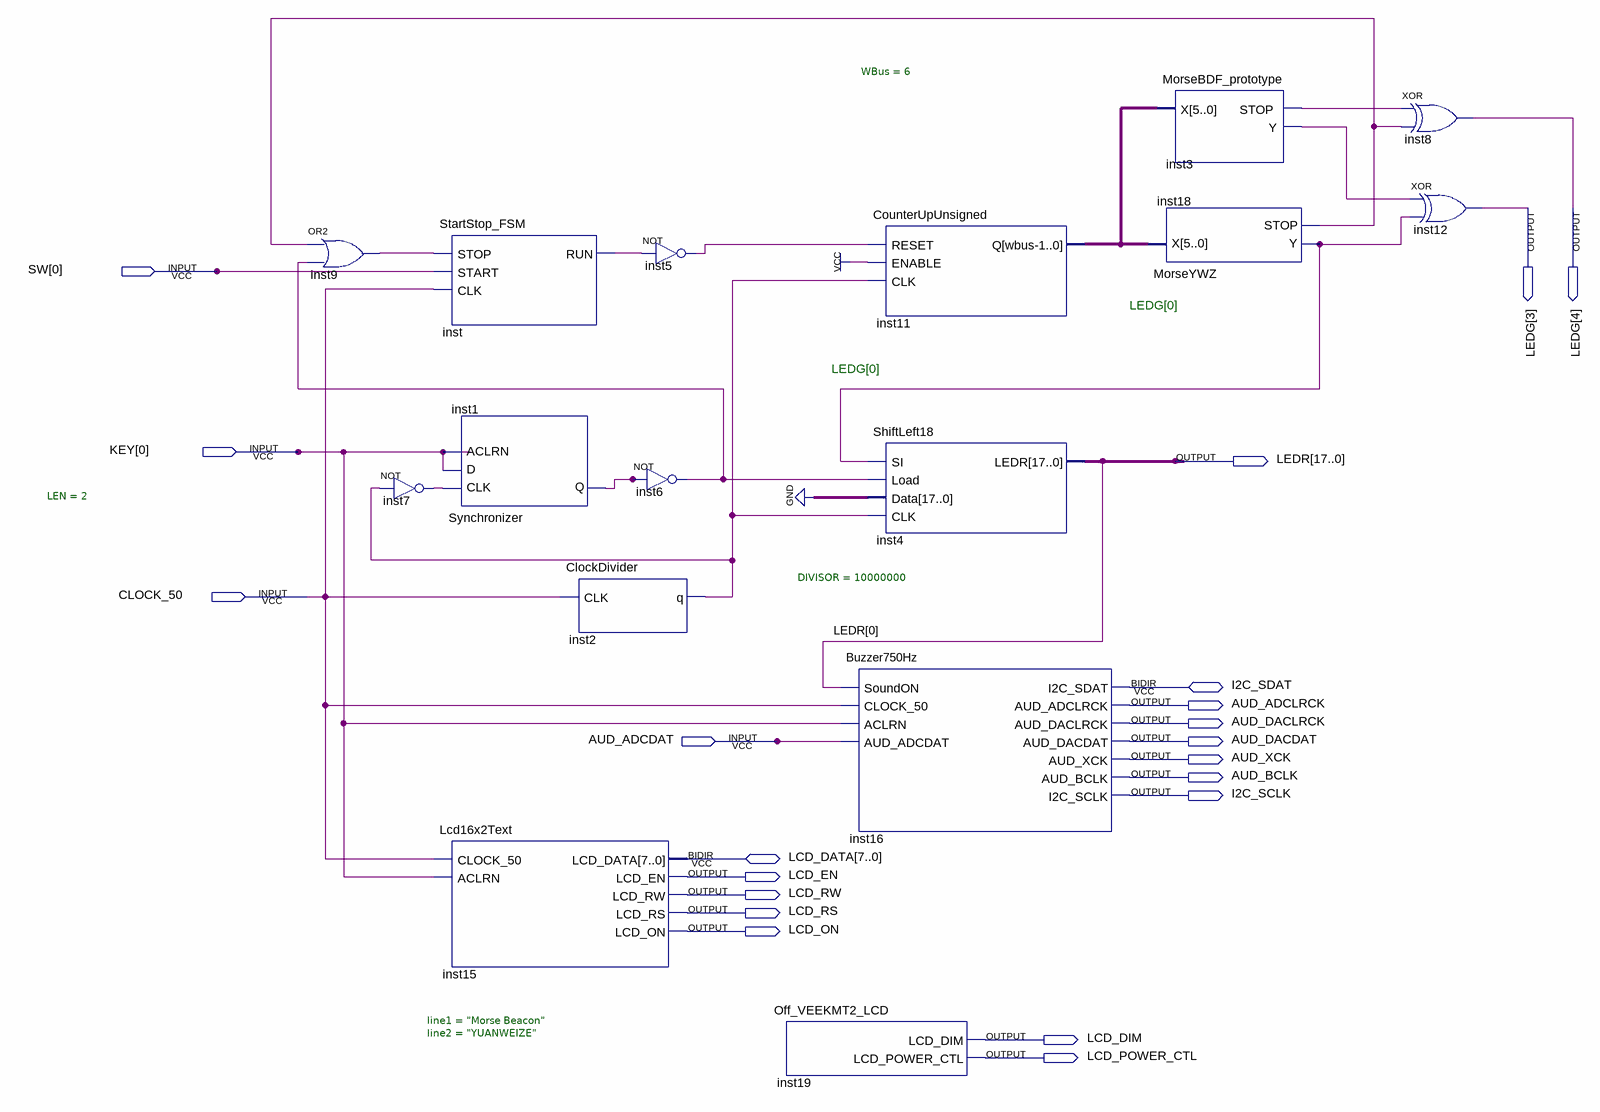
[diagram p0: schematic sheet]
// Quartus schematic task2.bdf as structural Verilog: 16 symbols, 21 pins
module task2 (
  input  [0:0] SW,
  input  [0:0] KEY,
  input  CLOCK_50,
  input  AUD_ADCDAT,
  inout  I2C_SDAT,
  inout  [7:0] LCD_DATA,
  output [4:3] LEDG,
  output [17:0] LEDR,
  output AUD_ADCLRCK,
  output AUD_DACLRCK,
  output AUD_DACDAT,
  output AUD_XCK,
  output AUD_BCLK,
  output I2C_SCLK,
  output LCD_EN,
  output LCD_RW,
  output LCD_RS,
  output LCD_ON,
  output LCD_DIM,
  output LCD_POWER_CTL
);

  wire inst1_q, inst2_q, inst3_stop, inst3_y, inst5_out, inst6_out, inst7_out, inst9_out, inst18_stop,
       inst18_y, inst_run;
  wire [5:0] inst11_q;

  or inst9 (inst9_out, inst18_stop, inst6_out);
  not inst7 (inst7_out, inst2_q);
  StartStop_FSM inst (.STOP(inst9_out), .START(SW[0]), .CLK(CLOCK_50), .RUN(inst_run));
  Synchronizer #(.LEN(2)) inst1 (.CLK(inst7_out), .D(KEY[0]), .ACLRN(KEY[0]), .Q(inst1_q));
  Lcd16x2Text #(.line1("Morse Beacon"), .line2("YUANWEIZE")) inst15 (
    .CLOCK_50(CLOCK_50), .ACLRN(KEY[0]), .LCD_EN(LCD_EN), .LCD_RW(LCD_RW), .LCD_RS(LCD_RS), .LCD_ON(LCD_ON),
    .LCD_DATA(LCD_DATA));
  ClockDivider #(.DIVISOR(10000000)) inst2 (.CLK(CLOCK_50), .q(inst2_q));
  not inst5 (inst5_out, inst_run);
  not inst6 (inst6_out, inst1_q);
  Off_VEEKMT2_LCD inst19 (.LCD_DIM(LCD_DIM), .LCD_POWER_CTL(LCD_POWER_CTL));
  Buzzer750Hz inst16 (
    .SoundON(LEDR[0]), .CLOCK_50(CLOCK_50), .ACLRN(KEY[0]), .AUD_ADCDAT(AUD_ADCDAT),
    .AUD_ADCLRCK(AUD_ADCLRCK), .AUD_DACLRCK(AUD_DACLRCK), .AUD_DACDAT(AUD_DACDAT), .AUD_XCK(AUD_XCK),
    .AUD_BCLK(AUD_BCLK), .I2C_SCLK(I2C_SCLK), .I2C_SDAT(I2C_SDAT));
  CounterUpUnsigned #(.WBus(6)) inst11 (.RESET(inst5_out), .ENABLE(1'b1), .CLK(inst2_q), .Q(inst11_q));
  ShiftLeft18 inst4 (.SI(inst18_y), .Load(inst6_out), .Data({18{1'b0}}), .CLK(inst2_q), .LEDR(LEDR));
  MorseBDF_prototype inst3 (.X(inst11_q), .STOP(inst3_stop), .Y(inst3_y));
  MorseYWZ inst18 (.X(inst11_q), .Y(inst18_y), .STOP(inst18_stop));
  xor inst8 (LEDG[4], inst3_stop, inst18_stop);
  xor inst12 (LEDG[3], inst3_y, inst18_y);

  // Notes on the sheet:
  //   LEDG[0]
  //   LEDG[0]
endmodule
